# Altium schematic sheet Power_3.schdoc: TEBF0808 - Power
size A4; DocumentNumber: TEBF0808; Revision: 04; SheetNumber: 33; SheetTotal: 36; Date: 2016-09-29; CompanyName: Trenz Electronic GmbH; Organization: Trenz Electronic GmbH
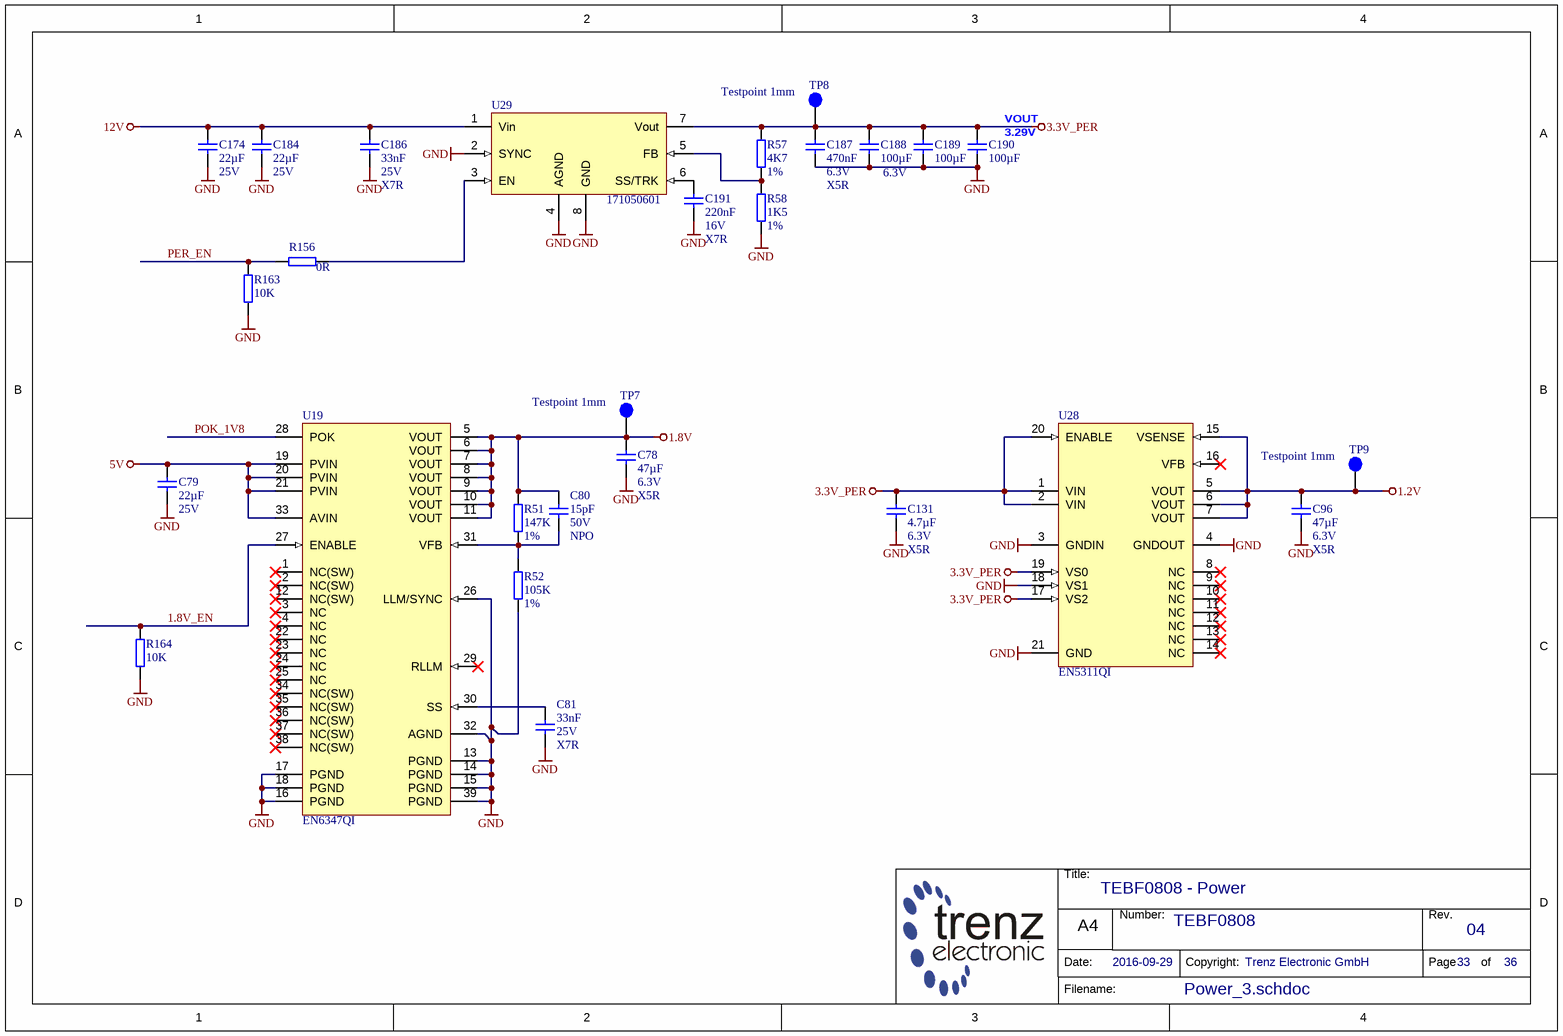
[diagram p0: Power_3.schdoc]

## Parts
C78  47µF  Voltage: 6.3V  Technology: X5R  [CAPC3216X180N]
C79  22µF  Voltage: 25V  [CAPC3216X180N]
C80  15pF  Voltage: 50V  Technology: NPO  [CAPC1005X55N]
C81  33nF  Voltage: 25V  Technology: X7R  [CAPC1005X55N]
C96  47µF  Voltage: 6.3V  Technology: X5R  [CAPC3216X180N]
C131  4.7µF  Voltage: 6.3V  Technology: X5R  [CAPC1005X60N]
C174  22µF  Voltage: 25V  [CAPC3216X180N]
C184  22µF  Voltage: 25V  [CAPC3216X180N]
C186  33nF  Voltage: 25V  Technology: X7R  [CAPC1005X55N]
C187  470nF  Voltage: 6.3V  Technology: X5R  [CAPC1005X55N]
C188  100µF  Voltage: 6.3V  [CAPC3216X180N]
C189  100µF  [CAPC3216X180N]
C190  100µF  [CAPC3216X180N]
C191  220nF  Voltage: 16V  Technology: X7R  [CAPC1005X55N]
R51  147K  Tolerance: 1%  [RESC1005X40N]
R52  105K  Tolerance: 1%  [RESC1005X40N]
R57  4K7  Tolerance: 1%  [RESC1005X40N]
R58  1K5  Tolerance: 1%  [RESC1005X40N]
R156  0R  [RESC1005X40N]
R163  10K  [RESC1005X40N]
R164  10K  [RESC1005X40N]
TP7  Testpoint 1mm  [TP_1mm]
TP8  Testpoint 1mm  [TP_1mm]
TP9  Testpoint 1mm  [TP_1mm]
U19  EN6347QI  [EN63xx]
U28  EN5311QI  [EN5311QI]
U29  171050601  [7TO-PMOD]

## Nets
1.2V: C96.1 TP9.1 U28.5(VOUT) U28.6(VOUT) U28.7(VOUT) U28.15(VSENSE)
1.8V: C78.1 C80.1 R51.2 TP7.1 U19.5(VOUT) U19.6(VOUT) U19.7(VOUT) U19.8(VOUT) U19.9(VOUT) U19.10(VOUT) U19.11(VOUT)
3.3V_PER: C131.1 C187.1 C188.1 C189.1 C190.1 R57.1 TP8.1 U28.1(VIN) U28.2(VIN) U28.17(VS2) U28.19(VS0) U28.20(ENABLE) U29.7(Vout)
5V: C79.2 U19.19(PVIN) U19.20(PVIN) U19.21(PVIN) U19.33(AVIN)
12V: C174.2 C184.2 C186.1 U29.1(Vin)
GND: C78.2 C79.1 C81.2 C96.2 C131.2 C174.1 C184.1 C186.2 C187.2 C188.2 C189.2 C190.2 C191.2 R52.2 R58.2 R163.1 R164.1 U19.13(PGND) U19.14(PGND) U19.15(PGND) U19.16(PGND) U19.17(PGND) U19.18(PGND) U19.26(LLM/SYNC) U19.32(AGND) U19.39(PGND) U28.3(GNDIN) U28.4(GNDOUT) U28.18(VS1) U28.21(GND) U29.2(SYNC) U29.4(AGND) U29.8(GND)
1.8V_EN: R164.2 U19.27(ENABLE)
PER_EN: R156.2 R163.2
POK_1V8: U19.28(POK)
NetC80_2: C80.2 R51.1 R52.1 U19.31(VFB)
NetC81_1: C81.1 U19.30(SS)
NetC191_1: C191.1 U29.6(SS/TRK)
NetR57_2: R57.2 R58.1 U29.5(FB)
NetR156_1: R156.1 U29.3(EN)

Not connected (* = marked no-connect by the designer): U19 1(NC(SW))* 2(NC(SW))* 3(NC)* 4(NC)* 12(NC(SW))* 22(NC)* 23(NC)* 24(NC)* 25(NC)* 29(RLLM)* 34(NC(SW))* 35(NC(SW))* 36(NC(SW))* 37(NC(SW))* 38(NC(SW))*; U28 8(NC)* 9(NC)* 10(NC)* 11(NC)* 12(NC)* 13(NC)* 14(NC)* 16(VFB)*

## Notes on the sheet
- (near C190) VOUT
- (near C190) 3.29V
- Title:
- Number:
- Rev.
- Date:
- A4
- Copyright:
- Page
- of
- Filename:

## Library data of the parts
C78 C96 = 24557: KON 47µF 6.3V  X5R SMD 20%; AN: 24557; Value: 47u; Mixed: SMT; Preferred: Yes; Case: 3216 (1206); Tolerance: 20%
C79 C174 C184 = 24886: KON 22µF X5R 25V SMD 10%; AN: 24886; Value: 22u; Mixed: SMT; Preferred: Yes; Case: 3216 (1206); Tolerance: 10%
C80 = 23951: KON 15pF NPO 50V SMD; AN: 23951; Value: 15p; Mixed: SMT; Preferred: Yes; Case: 1005 (0402)
C81 C186 = 23916: KON 33nF 25V X7R SMD; AN: 23916; Value: 33n; Mixed: SMT; Preferred: Yes; Case: 1005 (0402)
C131 = 24719: KON 4.7µF 6.3V X5R SMD 20%; AN: 24719; Mixed: SMT; Value: 4.7u; Preferred: Yes; Case: 1005 (0402); Tolerance: 20%
C187 = 23659: KON 470nF 6,3V X5R SMD; AN: 23659; Mixed: SMT; Value: 470n; Preferred: Yes; Case: 1005 (0402)
C188 = 23116: KON 100µF 6,3V X5R SMD 20%; AN: 23116; Mixed: SMT; Value: 100u; Preferred: Yes; Case: 3216 (1206); Tolerance: 20%; Technology: X5R
C189 C190 = 23116: KON 100µF 6,3V X5R SMD 20%; AN: 23116; Mixed: SMT; Value: 100u; Preferred: Yes; Voltage: 6.3V; Case: 3216 (1206); Tolerance: 20%; Technology: X5R
C191 = 22768: KON 220nF 16V X7R SMD; AN: 22768; Mixed: SMT; Value: 220n; Case: 1005 (0402)
R51 = 26470: WID SMD 147K 1% 0,063W; AN: 26470; Mixed: SMT; Preferred: Yes; Case: 1005 (0402); Technology: TK100; Value: 147K
R52 = 26467: WID SMD 105K 1% 0,063W; AN: 26467; Mixed: SMT; Preferred: Yes; Case: 1005 (0402); Technology: TK100; Value: 105K
R57 = 22585: WID SMD 4K7 1% 0,063W; AN: 22585; Mixed: SMT; Value: 4.7K; Preferred: Yes; Case: 1005 (0402); Technology: TK100
R58 = 22602: WID SMD 1K5 1% 0,063W; AN: 22602; Mixed: SMT; Value: 1.5K; Preferred: Yes; Case: 1005 (0402); Technology: TK100
R156 = 22738: WID SMD 0R; AN: 22738; Tolerance: 1%; Mixed: SMT; Value: 0; Preferred: Yes; Case: 1005 (0402); Technology: TK100
R163 R164 = 22750: WID SMD 10K 1% 0,063W; AN: 22750; Mixed: SMT; Preferred: Yes; Case: 1005 (0402); Value: 10K; Tolerance: 1%; Technology: TK100
TP7-TP9 = 25063: AN: 25063; Mixed: SMT
U19 = 24486: AN: 24486; Trenz-Stock: Yes; Mixed: SMT; HelpURL: B:\AD\adlib\datasheet\EN6347QI; Preferred: Yes; H-ART: EN6347QI
U28 = 25492: AN: 25492; Mixed: SMT; Trenz-Stock: Yes; Case: QFN20; HelpURL: B:\AD\adlib\datasheet\EN5311QI; Preferred: Yes; H-ART: EN5311QI
U29 = 26051: AN: 26051; Mixed: SMT; Case: TO263-7EP; HelpURL: B:\AD\adlib\datasheet\171050601; H-ART: 171050601